# EasyEDA schematic SCH_SNES2NEO_2025-12-20.json
TITLE: SNES to MVS controller; REV: 1.0; Date: 2025-12-20; Sheet: 1/1; Company: BOICHOT
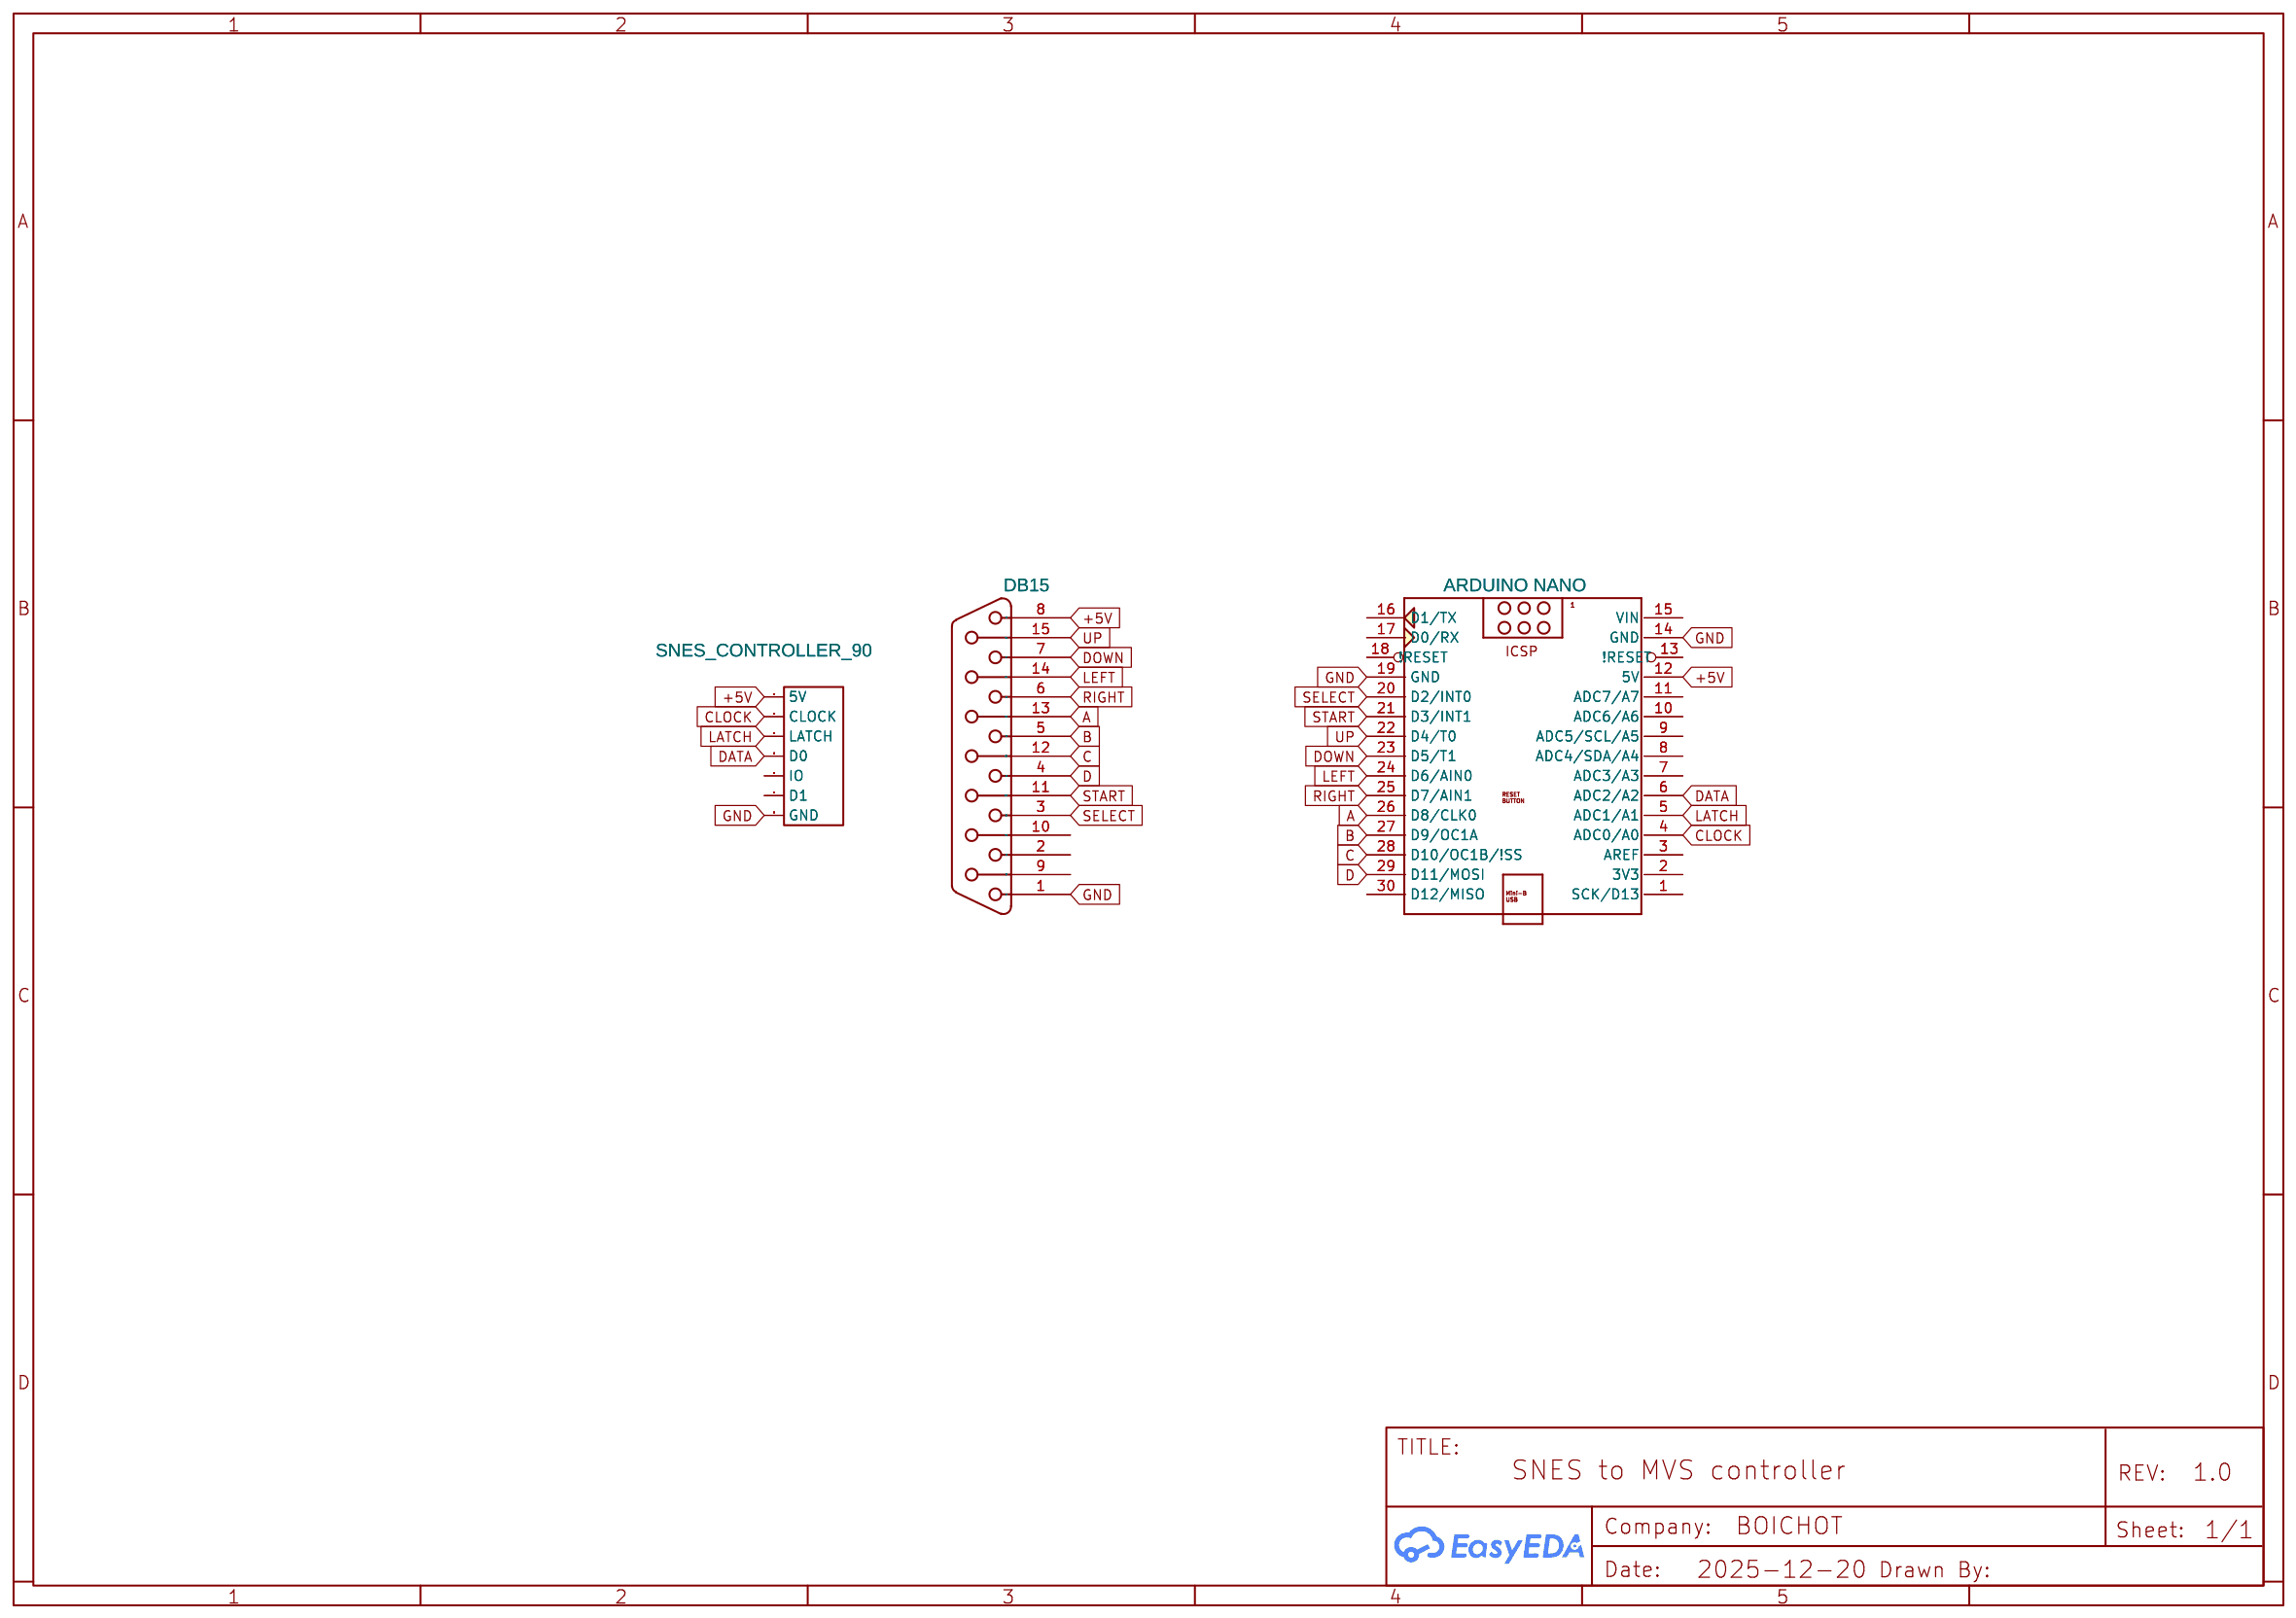
[diagram p0: schematic sheet]

## Parts
ARDUINO_NANO1  ARDUINO NANO  [ARDUINONANOV30_ARDUINO_NANO]
H1  SNES_CONTROLLER_90  [SNES_CONTROLLER_90]
J1  DB15  [DB15-M]

## Library data of the parts
ARDUINO_NANO1 = ARDUINO NANO: Contributor: hrodriguez22
H1 = SNES_CONTROLLER_90: Contributor: jbarber
J1 = DB15: Contributor: SmartPrototype

## Nets
+5V: ARDUINO_NANO1.12(5V) H1.5V J1.8
GND: ARDUINO_NANO1.14(GND) ARDUINO_NANO1.19(GND) H1.GND J1.1
A: ARDUINO_NANO1.26(D8/CLK0) J1.13(P13)
B: ARDUINO_NANO1.27(D9/OC1A) J1.5
C: ARDUINO_NANO1.28(D10/OC1B/!SS) J1.12(P12)
CLOCK: ARDUINO_NANO1.4(ADC0/A0) H1.CLOCK
D: ARDUINO_NANO1.29(D11/MOSI) J1.4
DATA: ARDUINO_NANO1.6(ADC2/A2) H1.D0
DOWN: ARDUINO_NANO1.23(D5/T1) J1.7
LATCH: ARDUINO_NANO1.5(ADC1/A1) H1.LATCH
LEFT: ARDUINO_NANO1.24(D6/AIN0) J1.14(P14)
RIGHT: ARDUINO_NANO1.25(D7/AIN1) J1.6
SELECT: ARDUINO_NANO1.20(D2/INT0) J1.3
START: ARDUINO_NANO1.21(D3/INT1) J1.11(P111)
UP: ARDUINO_NANO1.22(D4/T0) J1.15(P15)

Not connected (* = marked no-connect by the designer): ARDUINO_NANO1 1(SCK/D13) 2(3V3) 3(AREF) 7(ADC3/A3) 8(ADC4/SDA/A4) 9(ADC5/SCL/A5) 10(ADC6/A6) 11(ADC7/A7) 13(!RESET) 15(VIN) 16(D1/TX) 17(D0/RX) 18(!RESET) 30(D12/MISO); H1 D1 IO; J1 2 9(P9) 10(P10)
